# Altium project Frequenzweiche.PrjPcb
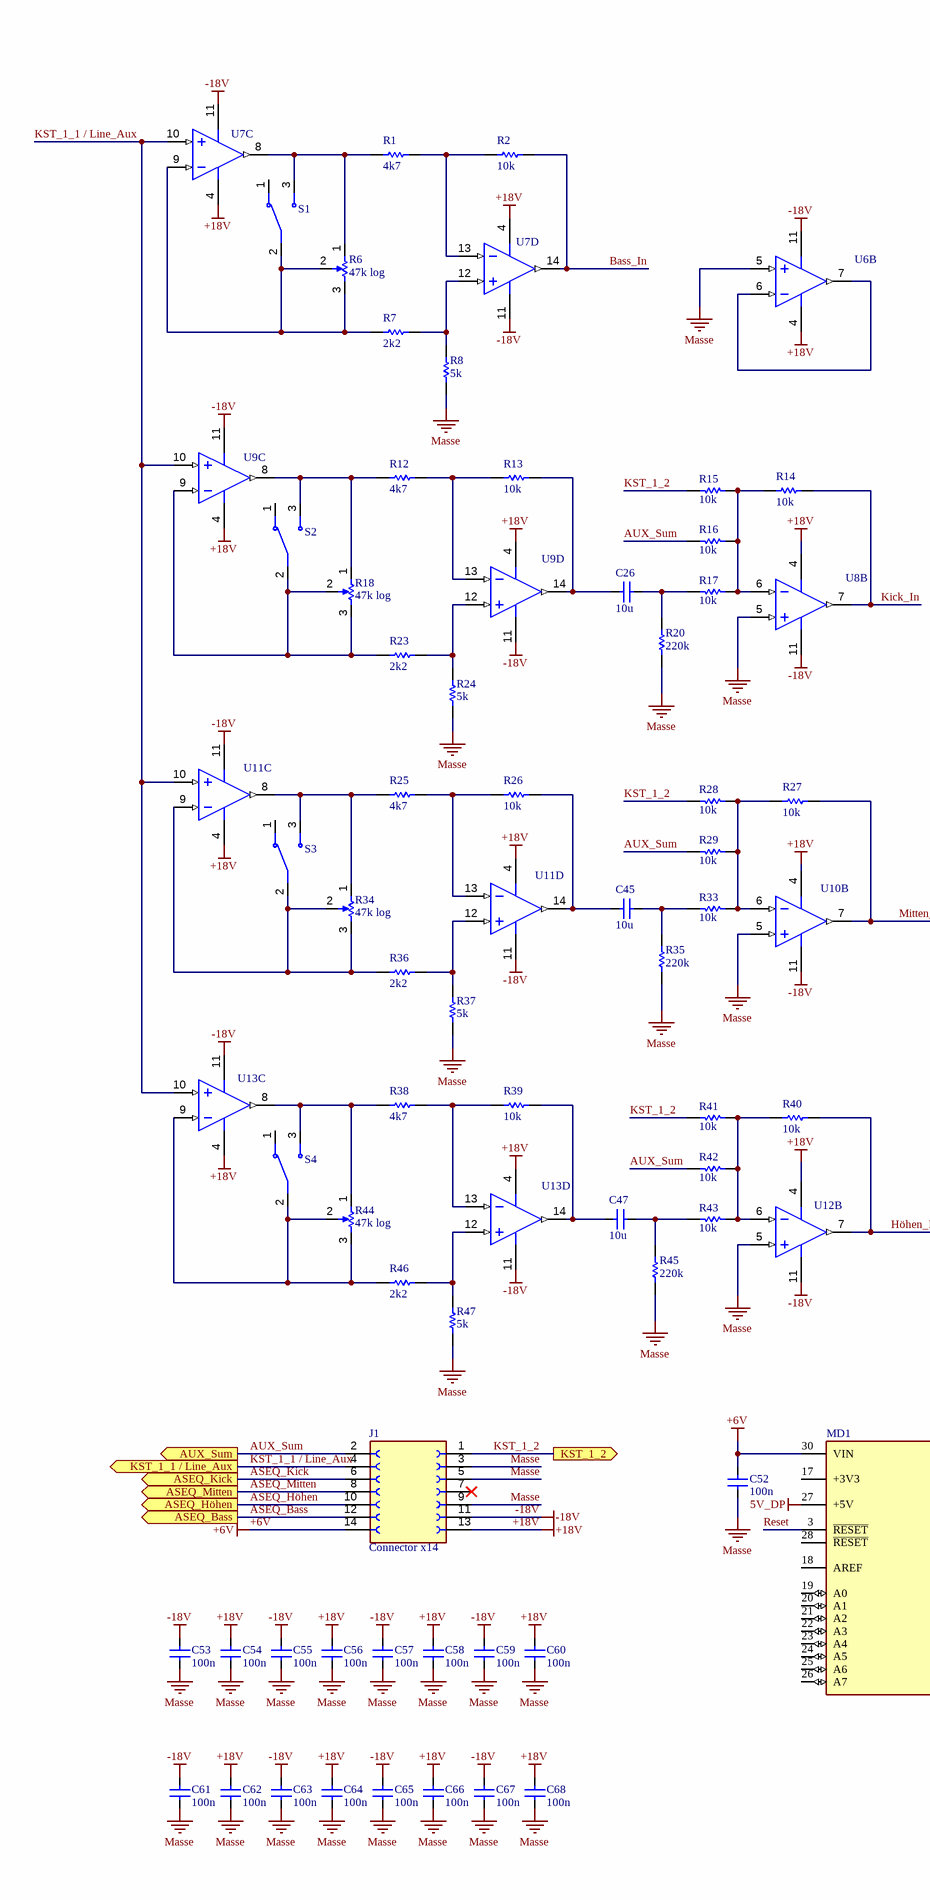
[diagram p0: Frequenzweiche.SchDoc, left]
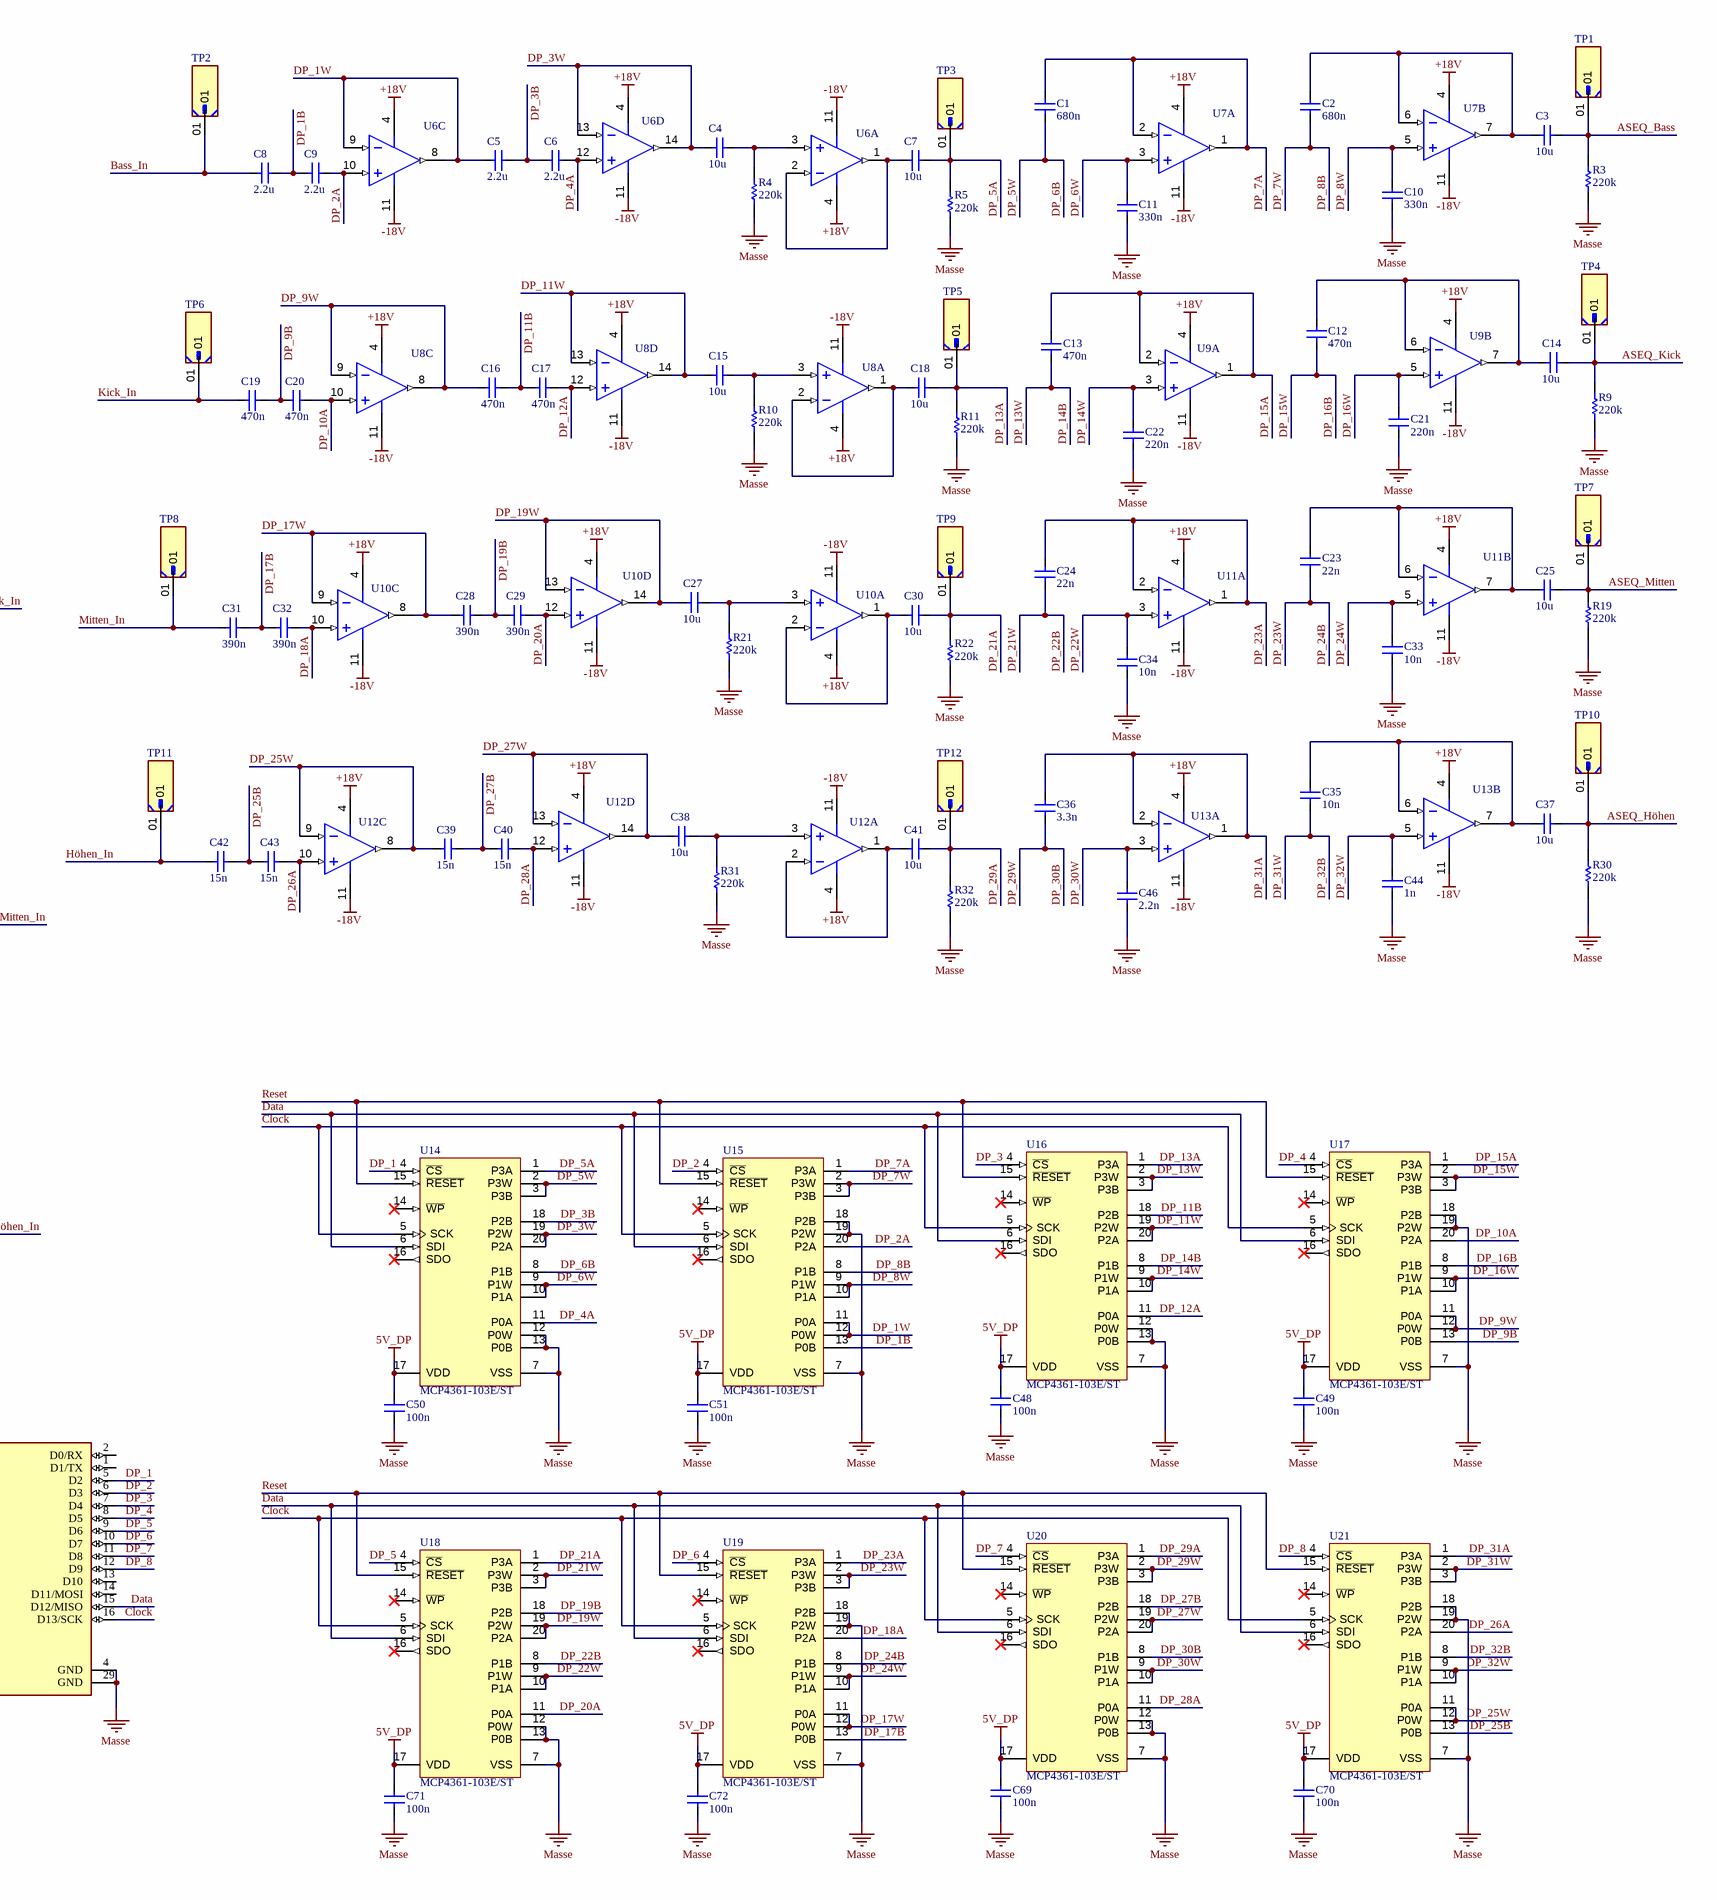
[diagram p1: Frequenzweiche.SchDoc, right]
1 sheet, 153 parts. Net scope: flat (ports and power ports of the same name join across sheets).
Board file: Frequenzweiche.PcbDoc

## Sheet Frequenzweiche.SchDoc
size A2

### Parts
C1  680n  [0805]
C2  680n  [0805]
C3  10u  [0805]
C4  10u  [0805]
C5  2.2u  [0805]
C6  2.2u  [0805]
C7  10u  [0805]
C8  2.2u  [0805]
C9  2.2u  [0805]
C10  330n  [0805]
C11  330n  [0805]
C12  470n  [0805]
C13  470n  [0805]
C14  10u  [0805]
C15  10u  [0805]
C16  470n  [0805]
C17  470n  [0805]
C18  10u  [0805]
C19  470n  [0805]
C20  470n  [0805]
C21  220n  [0805]
C22  220n  [0805]
C23  22n  [0805]
C24  22n  [0805]
C25  10u  [0805]
C26  10u  [0805]
C27  10u  [0805]
C28  390n  [0805]
C29  390n  [0805]
C30  10u  [0805]
C31  390n  [0805]
C32  390n  [0805]
C33  10n  [0805]
C34  10n  [0805]
C35  10n  [0805]
C36  3.3n  [0805]
C37  10u  [0805]
C38  10u  [0805]
C39  15n  [0805]
C40  15n  [0805]
C41  10u  [0805]
C42  15n  [0805]
C43  15n  [0805]
C44  1n  [0805]
C45  10u  [0805]
C46  2.2n  [0805]
C47  10u  [0805]
C48  100n  [0805]
C49  100n  [0805]
C50  100n  [0805]
C51  100n  [0805]
C52  100n  [0805]
C53  100n  [0805]
C54  100n  [0805]
C55  100n  [0805]
C56  100n  [0805]
C57  100n  [0805]
C58  100n  [0805]
C59  100n  [0805]
C60  100n  [0805]
C61  100n  [0805]
C62  100n  [0805]
C63  100n  [0805]
C64  100n  [0805]
C65  100n  [0805]
C66  100n  [0805]
C67  100n  [0805]
C68  100n  [0805]
C69  100n  [0805]
C70  100n  [0805]
C71  100n  [0805]
C72  100n  [0805]
J1  Connector x14  [Connector x14]
MD1  A000005  [Arduino Nano]  (value not drawn)
R1  4k7  [0805]
R2  10k  [0805]
R3  220k  [0805]
R4  220k  [0805]
R5  220k  [0805]
R6  47k log  [Connector x3]
R7  2k2  [0805]
R8  5k  [0805]
R9  220k  [0805]
R10  220k  [0805]
R11  220k  [0805]
R12  4k7  [0805]
R13  10k  [0805]
R14  10k  [0805]
R15  10k  [0805]
R16  10k  [0805]
R17  10k  [0805]
R18  47k log  [Connector x3]
R19  220k  [0805]
R20  220k  [0805]
R21  220k  [0805]
R22  220k  [0805]
R23  2k2  [0805]
R24  5k  [0805]
R25  4k7  [0805]
R26  10k  [0805]
R27  10k  [0805]
R28  10k  [0805]
R29  10k  [0805]
R30  220k  [0805]
R31  220k  [0805]
R32  220k  [0805]
R33  10k  [0805]
R34  47k log  [Connector x3]
R35  220k  [0805]
R36  2k2  [0805]
R37  5k  [0805]
R38  4k7  [0805]
R39  10k  [0805]
R40  10k  [0805]
R41  10k  [0805]
R42  10k  [0805]
R43  10k  [0805]
R44  47k log  [Connector x3]
R45  220k  [0805]
R46  2k2  [0805]
R47  5k  [0805]
S1  Schalter Buchsenleiste  [Connector x3]  (value not drawn)
S2  Schalter Buchsenleiste  [Connector x3]  (value not drawn)
S3  Schalter Buchsenleiste  [Connector x3]  (value not drawn)
S4  Schalter Buchsenleiste  [Connector x3]  (value not drawn)
TP1  Test_Pin  [Test_Pin]  (value not drawn)
TP2  Test_Pin  [Test_Pin]  (value not drawn)
TP3  Test_Pin  [Test_Pin]  (value not drawn)
TP4  Test_Pin  [Test_Pin]  (value not drawn)
TP5  Test_Pin  [Test_Pin]  (value not drawn)
TP6  Test_Pin  [Test_Pin]  (value not drawn)
TP7  Test_Pin  [Test_Pin]  (value not drawn)
TP8  Test_Pin  [Test_Pin]  (value not drawn)
TP9  Test_Pin  [Test_Pin]  (value not drawn)
TP10  Test_Pin  [Test_Pin]  (value not drawn)
TP11  Test_Pin  [Test_Pin]  (value not drawn)
TP12  Test_Pin  [Test_Pin]  (value not drawn)
U6  OPA4134UA  [DIP14 IC Socket]  (value not drawn)  (parts A,B,C,D of 4)
U7  OPA4134UA  [DIP14 IC Socket]  (value not drawn)  (parts A,B,C,D of 4)
U8  OPA4134UA  [DIP14 IC Socket]  (value not drawn)  (parts A,B,C,D of 4)
U9  OPA4134UA  [DIP14 IC Socket]  (value not drawn)  (parts A,B,C,D of 4)
U10  OPA4134UA  [DIP14 IC Socket]  (value not drawn)  (parts A,B,C,D of 4)
U11  OPA4134UA  [DIP14 IC Socket]  (value not drawn)  (parts A,B,C,D of 4)
U12  OPA4134UA  [DIP14 IC Socket]  (value not drawn)  (parts A,B,C,D of 4)
U13  OPA4134UA  [DIP14 IC Socket]  (value not drawn)  (parts A,B,C,D of 4)
U14  MCP4361-103E/ST  [MCP 4361]
U15  MCP4361-103E/ST  [MCP 4361]
U16  MCP4361-103E/ST  [MCP 4361]
U17  MCP4361-103E/ST  [MCP 4361]
U18  MCP4361-103E/ST  [MCP 4361]
U19  MCP4361-103E/ST  [MCP 4361]
U20  MCP4361-103E/ST  [MCP 4361]
U21  MCP4361-103E/ST  [MCP 4361]

### Ports
ASEQ_Bass (out), ASEQ_Höhen (out), ASEQ_Kick (out), ASEQ_Mitten (out), AUX_Sum (out), KST_1_1 / Line_Aux (out), KST_1_2 (out)

### Nets
5V_DP: C48.2 C49.2 C50.2 C51.2 C69.2 C70.2 C71.2 C72.2 MD1.27(+5V) U14.17(VDD) U15.17(VDD) U16.17(VDD) U17.17(VDD) U18.17(VDD) U19.17(VDD) U20.17(VDD) U21.17(VDD)
+6V: C52.2 J1.14 MD1.30(VIN)
+18V: C54.2 C56.2 C58.2 C60.2 C62.2 C64.2 C66.2 C68.2 J1.13 U6.4(V+) U7.4(V+) U8.4(V+) U9.4(V+) U10.4(V+) U11.4(V+) U12.4(V+) U13.4(V+)
-18V: C53.2 C55.2 C57.2 C59.2 C61.2 C63.2 C65.2 C67.2 J1.11 U6.11(V-) U7.11(V-) U8.11(V-) U9.11(V-) U10.11(V-) U11.11(V-) U12.11(V-) U13.11(V-)
Masse: C10.1 C11.1 C21.1 C22.1 C33.1 C34.1 C44.1 C46.1 C48.1 C49.1 C50.1 C51.1 C52.1 C53.1 C54.1 C55.1 C56.1 C57.1 C58.1 C59.1 C60.1 C61.1 C62.1 C63.1 C64.1 C65.1 C66.1 C67.1 C68.1 C69.1 C70.1 C71.1 C72.1 J1.3 J1.5 J1.9 MD1.4(GND) MD1.29(GND) R3.1 R4.1 R5.1 R8.1 R9.1 R10.1 R11.1 R19.1 R20.1 R21.1 R22.1 R24.1 R30.1 R31.1 R32.1 R35.1 R37.1 R45.1 R47.1 U6.5(IN_B+) U8.5(IN_B+) U10.5(IN_B+) U12.5(IN_B+) U14.7(VSS) U14.12(P0W) U14.13(P0B) U15.7(VSS) U15.18(P2B) U15.19(P2W) U16.7(VSS) U16.12(P0W) U16.13(P0B) U17.7(VSS) U17.18(P2B) U17.19(P2W) U18.7(VSS) U18.12(P0W) U18.13(P0B) U19.7(VSS) U19.18(P2B) U19.19(P2W) U20.7(VSS) U20.12(P0W) U20.13(P0B) U21.7(VSS) U21.18(P2B) U21.19(P2W)
ASEQ_Bass: C3.2 J1.12 R3.2 TP1.01 ; port ASEQ_Bass
ASEQ_Höhen: C37.2 J1.10 R30.2 TP10.01 ; port ASEQ_Höhen
ASEQ_Kick: C14.2 J1.6 R9.2 TP4.01 ; port ASEQ_Kick
ASEQ_Mitten: C25.2 J1.8 R19.2 TP7.01 ; port ASEQ_Mitten
AUX_Sum: J1.2 R16.1 R29.1 R42.1 ; port AUX_Sum
Bass_In: C8.1 R2.2 TP2.01 U7.14(OUT_D)
Clock: MD1.16(D13/SCK) U14.5(SCK) U15.5(SCK) U16.5(SCK) U17.5(SCK) U18.5(SCK) U19.5(SCK) U20.5(SCK) U21.5(SCK)
Data: MD1.15(D12/MISO) U14.6(SDI) U15.6(SDI) U16.6(SDI) U17.6(SDI) U18.6(SDI) U19.6(SDI) U20.6(SDI) U21.6(SDI)
DP_1: MD1.5(D2) U14.4(~{CS})
DP_1B: C8.2 C9.1 U15.13(P0B)
DP_1W: C5.1 U6.8(OUT_C) U6.9(IN_C-) U15.11(P0A) U15.12(P0W)
DP_2: MD1.6(D3) U15.4(~{CS})
DP_2A: C9.2 U6.10(IN_C+) U15.20(P2A)
DP_3: MD1.7(D4) U16.4(~{CS})
DP_3B: C5.2 C6.1 U14.18(P2B)
DP_3W: C4.1 U6.13(IN_D-) U6.14(OUT_D) U14.19(P2W) U14.20(P2A)
DP_4: MD1.8(D5) U17.4(~{CS})
DP_4A: C6.2 U6.12(IN_D+) U14.11(P0A)
DP_5: MD1.9(D6) U18.4(~{CS})
DP_5A: C7.2 R5.2 TP3.01 U14.1(P3A)
DP_5W: C1.1 U14.2(P3W) U14.3(P3B) U14.8(P1B)  [also labelled DP_6B]
DP_6: MD1.10(D7) U19.4(~{CS})
DP_6W: C11.2 U7.3(IN_A+) U14.9(P1W) U14.10(P1A)
DP_7: MD1.11(D8) U20.4(~{CS})
DP_7A: C1.2 U7.1(OUT_A) U7.2(IN_A-) U15.1(P3A)
DP_7W: C2.1 U15.2(P3W) U15.3(P3B) U15.8(P1B)  [also labelled DP_8B]
DP_8: MD1.12(D9) U21.4(~{CS})
DP_8W: C10.2 U7.5(IN_B+) U15.9(P1W) U15.10(P1A)
DP_9B: C19.2 C20.1 U17.13(P0B)
DP_9W: C16.1 U8.8(OUT_C) U8.9(IN_C-) U17.11(P0A) U17.12(P0W)
DP_10A: C20.2 U8.10(IN_C+) U17.20(P2A)
DP_11B: C16.2 C17.1 U16.18(P2B)
DP_11W: C15.1 U8.13(IN_D-) U8.14(OUT_D) U16.19(P2W) U16.20(P2A)
DP_12A: C17.2 U8.12(IN_D+) U16.11(P0A)
DP_13A: C18.2 R11.2 TP5.01 U16.1(P3A)
DP_13W: C13.1 U16.2(P3W) U16.3(P3B) U16.8(P1B)  [also labelled DP_14B]
DP_14W: C22.2 U9.3(IN_A+) U16.9(P1W) U16.10(P1A)
DP_15A: C13.2 U9.1(OUT_A) U9.2(IN_A-) U17.1(P3A)
DP_15W: C12.1 U17.2(P3W) U17.3(P3B) U17.8(P1B)  [also labelled DP_16B]
DP_16W: C21.2 U9.5(IN_B+) U17.9(P1W) U17.10(P1A)
DP_17B: C31.2 C32.1 U19.13(P0B)
DP_17W: C28.1 U10.8(OUT_C) U10.9(IN_C-) U19.11(P0A) U19.12(P0W)
DP_18A: C32.2 U10.10(IN_C+) U19.20(P2A)
DP_19B: C28.2 C29.1 U18.18(P2B)
DP_19W: C27.1 U10.13(IN_D-) U10.14(OUT_D) U18.19(P2W) U18.20(P2A)
DP_20A: C29.2 U10.12(IN_D+) U18.11(P0A)
DP_21A: C30.2 R22.2 TP9.01 U18.1(P3A)
DP_21W: C24.1 U18.2(P3W) U18.3(P3B) U18.8(P1B)  [also labelled DP_22B]
DP_22W: C34.2 U11.3(IN_A+) U18.9(P1W) U18.10(P1A)
DP_23A: C24.2 U11.1(OUT_A) U11.2(IN_A-) U19.1(P3A)
DP_23W: C23.1 U19.2(P3W) U19.3(P3B) U19.8(P1B)  [also labelled DP_24B]
DP_24W: C33.2 U11.5(IN_B+) U19.9(P1W) U19.10(P1A)
DP_25B: C42.2 C43.1 U21.13(P0B)
DP_25W: C39.1 U12.8(OUT_C) U12.9(IN_C-) U21.11(P0A) U21.12(P0W)
DP_26A: C43.2 U12.10(IN_C+) U21.20(P2A)
DP_27B: C39.2 C40.1 U20.18(P2B)
DP_27W: C38.1 U12.13(IN_D-) U12.14(OUT_D) U20.19(P2W) U20.20(P2A)
DP_28A: C40.2 U12.12(IN_D+) U20.11(P0A)
DP_29A: C41.2 R32.2 TP12.01 U20.1(P3A)
DP_29W: C36.1 U20.2(P3W) U20.3(P3B) U20.8(P1B)  [also labelled DP_30B]
DP_30W: C46.2 U13.3(IN_A+) U20.9(P1W) U20.10(P1A)
DP_31A: C36.2 U13.1(OUT_A) U13.2(IN_A-) U21.1(P3A)
DP_31W: C35.1 U21.2(P3W) U21.3(P3B) U21.8(P1B)  [also labelled DP_32B]
DP_32W: C44.2 U13.5(IN_B+) U21.9(P1W) U21.10(P1A)
Höhen_In: C42.1 R40.2 TP11.01 U12.7(OUT_B)
Kick_In: C19.1 R14.2 TP6.01 U8.7(OUT_B)
KST_1_1 / Line_Aux: J1.4 U7.10(IN_C+) U9.10(IN_C+) U11.10(IN_C+) U13.10(IN_C+) ; port KST_1_1 / Line_Aux
KST_1_2: J1.1 R15.1 R28.1 R41.1 ; port KST_1_2
Mitten_In: C31.1 R27.2 TP8.01 U10.7(OUT_B)
Reset: MD1.3(~{RESET}) U14.15(~{RESET}) U15.15(~{RESET}) U16.15(~{RESET}) U17.15(~{RESET}) U18.15(~{RESET}) U19.15(~{RESET}) U20.15(~{RESET}) U21.15(~{RESET})
NetC2_2: C2.2 C3.1 U7.6(IN_B-) U7.7(OUT_B)
NetC4_2: C4.2 R4.2 U6.3(IN_A+)
NetC7_1: C7.1 U6.1(OUT_A) U6.2(IN_A-)
NetC12_2: C12.2 C14.1 U9.6(IN_B-) U9.7(OUT_B)
NetC15_2: C15.2 R10.2 U8.3(IN_A+)
NetC18_1: C18.1 U8.1(OUT_A) U8.2(IN_A-)
NetC23_2: C23.2 C25.1 U11.6(IN_B-) U11.7(OUT_B)
NetC26_1: C26.1 R13.2 U9.14(OUT_D)
NetC26_2: C26.2 R17.1 R20.2
NetC27_2: C27.2 R21.2 U10.3(IN_A+)
NetC30_1: C30.1 U10.1(OUT_A) U10.2(IN_A-)
NetC35_2: C35.2 C37.1 U13.6(IN_B-) U13.7(OUT_B)
NetC38_2: C38.2 R31.2 U12.3(IN_A+)
NetC41_1: C41.1 U12.1(OUT_A) U12.2(IN_A-)
NetC45_1: C45.1 R26.2 U11.14(OUT_D)
NetC45_2: C45.2 R33.1 R35.2
NetC47_1: C47.1 R39.2 U13.14(OUT_D)
NetC47_2: C47.2 R43.1 R45.2
NetR1_1: R1.1 R6.1 S1.3 U7.8(OUT_C)
NetR1_2: R1.2 R2.1 U7.13(IN_D-)
NetR6_2: R6.2 R6.3 R7.1 S1.2 U7.9(IN_C-)
NetR7_2: R7.2 R8.2 U7.12(IN_D+)
NetR12_1: R12.1 R18.1 S2.3 U9.8(OUT_C)
NetR12_2: R12.2 R13.1 U9.13(IN_D-)
NetR14_1: R14.1 R15.2 R16.2 R17.2 U8.6(IN_B-)
NetR18_2: R18.2 R18.3 R23.1 S2.2 U9.9(IN_C-)
NetR23_2: R23.2 R24.2 U9.12(IN_D+)
NetR25_1: R25.1 R34.1 S3.3 U11.8(OUT_C)
NetR25_2: R25.2 R26.1 U11.13(IN_D-)
NetR27_1: R27.1 R28.2 R29.2 R33.2 U10.6(IN_B-)
NetR34_2: R34.2 R34.3 R36.1 S3.2 U11.9(IN_C-)
NetR36_2: R36.2 R37.2 U11.12(IN_D+)
NetR38_1: R38.1 R44.1 S4.3 U13.8(OUT_C)
NetR38_2: R38.2 R39.1 U13.13(IN_D-)
NetR40_1: R40.1 R41.2 R42.2 R43.2 U12.6(IN_B-)
NetR44_2: R44.2 R44.3 R46.1 S4.2 U13.9(IN_C-)
NetR46_2: R46.2 R47.2 U13.12(IN_D+)
NetU6_6: U6.6(IN_B-) U6.7(OUT_B)

Not connected (* = marked no-connect by the designer): J1 7*; MD1 1(D1/TX) 2(D0/RX) 13(D10) 14(D11/MOSI) 17(+3V3) 18(AREF) 19(A0) 20(A1) 21(A2) 22(A3) 23(A4) 24(A5) 25(A6) 26(A7) 28(~{RESET}); S1 1; S2 1; S3 1; S4 1; U14 14(~{WP})* 16(SDO)*; U15 14(~{WP})* 16(SDO)*; U16 14(~{WP})* 16(SDO)*; U17 14(~{WP})* 16(SDO)*; U18 14(~{WP})* 16(SDO)*; U19 14(~{WP})* 16(SDO)*; U20 14(~{WP})* 16(SDO)*; U21 14(~{WP})* 16(SDO)*

### Notes on the sheet
- THIS DOCUMENT AND THE DATA DISCLOSED HEREIN OR
- HEREWITH IS THE PROPERTY OF ALTIUM LIMITED AND MAY
- DWG NO:
- REVISION
- REV:
- DESCRIPTION
- DATE
- APPROVED
- BE FREELY DISTRIBUTED IN WHOLE. NO RIGHTS ARE
- RESERVED OR EXPRESS OR IMPLIED WARANTEE GIVEN.
- ENG:
- APPROVALS
- PROJECT
- DSN:
- CHK:
- REFERENCE DOCUMENTS
- PROJECT REVISION:
- TITLE
- DOCUMENT REVISION:
- DESIGN ITEM:
- BOM:
- FAB DWG:
- PCB DWG:
- ASSY DWG:
- SCALE:
- A3
- SIZE
- CAGE CODE
- FILE NAME
- DWG NO.
- SHEET
- OF
- REV

### Library data of the parts
C1-C72 = 0805 Kondensator
  C1 C2: Value: 680n
  C3 C4 C7 C14 C15 C18 C25-C27 C30 C37 C38 C41 C45 C47: Value: 10u
  C5 C6 C8 C9: Value: 2.2u
  C10 C11: Value: 330n
  C12 C13 C16 C17 C19 C20: Value: 470n
  C21 C22: Value: 220n
  C23 C24: Value: 22n
  C28 C29 C31 C32: Value: 390n
  C33-C35: Value: 10n
  C36: Value: 3.3n
  C39 C40 C42 C43: Value: 15n
  C44: Value: 1n
  C46: Value: 2.2n
  C48-C72: Value: 100n
J1 = Connector x14: 14 Position Header Connector Through Hole; MF: Sullins Connector; MP: SFH11-PBPC-D07-ST-BK; Value: *; Check_prices: https://www.snapeda.com/parts/SFH11-PBPC-D07-ST-BK/Sullins%20Connector%20Solutions/view-part/851415/?ref=eda; Availability: Warning; Package: None; SnapEDA_Link: https://www.snapeda.com/parts/SFH11-PBPC-D07-ST-BK/Sullins%20Connector%20Solutions/view-part/851415/?ref=snap; Purchase-URL: https://pricing.snapeda.com/search/part/SFH11-PBPC-D07-ST-BK/?ref=eda; Price: None; System: Connector
MD1 = Arduino Nano: ARDUINO NANO ATMEGA328 EVAL BRD; Number of Bits: 8; Evaluation Kit: Yes; Operating Supply Voltage: 12V; Interface: I2C; Data Bus Width: 8b; Core Architecture: AVR; Packaging: Bulk; Length: 7inch; Package Quantity: 50; Width: 5inch; REACH SVHC: No SVHC; Weight: 0.358383oz; Series: AVR® ATmega; Height: 0.25inch
R1-R5 R7-R17 R19-R33 R35-R43 R45-R47 = 0805 Widerstand
  R1 R12 R25 R38: Value: 4k7
  R2 R13-R17 R26-R29 R33 R39-R43: Value: 10k
  R3-R5 R9-R11 R19-R22 R30-R32 R35 R45: Value: 220k
  R7 R23 R36 R46: Value: 2k2
  R8 R24 R37 R47: Value: 5k
R6 R18 R34 R44 = Potentiometer Buchsenleiste: Potentiometer; Value: 47k log
S1-S4 = Schalter Buchsenleiste: Toggle Switch SPDT Through Hole; MP: 100SP1T1B4M2QE; Package: None; Price: None; Value: *; Availability: Unavailable
TP1-TP12 = Test_Pin: Connector Header Through Hole 2 position 0.100 (2.54mm); MF: Wurth Elektronik; MP: 61300211121; SnapEDA_Link: https://www.snapeda.com/parts/61300211121/Wurth+Elektronik/view-part/?ref=snap; Package: None; Value: *; Check_prices: https://www.snapeda.com/parts/61300211121/Wurth+Elektronik/view-part/?ref=eda
U6-U13 = SOIC OPA4134UA: SoundPlus(TM) High Performance Audio Operational Amplifier, 5 to 36 V, -55 to 125 degC, 14-pin SOIC (D14), Green (RoHS & no Sb/Br); Manufacturer: Texas Instruments; Vmax(V): 36; Number of Channels: 4; Iq per channel(Max)(mA): 5; GBW(Typ)(MHz): 8; DatasheetVersion: SBOS058; ComponentLink2URL: http://www.ti.com/general/docs/lit/getliterature.tsp?genericPartNumber=OPA4134&fileType=pdf; ComponentLink1URL: http://www.ti.com/; PackageDescription: 14-Pin Plastic Small Outline, Body 8.65 x 3.9 mm, Pitch 1.27 mm; SubFamily: Audio Operational Amplifier; Vmin(V): 5; ComponentLink2Description: Datasheet; PackageVersion: 4040047-5/M, 06/2011; Code_JEDEC: MS-012; PackageReference: D0014A; ComponentLink1Description: Manufacturer URL; Vn at Flatband(Typ)(nV/rtHz): 8; Eco-Plan: Green (RoHS & no Sb/Br); Mounting Technology: Surface Mount; ComponentLink3URL: http://www.ti.com/lit/ml/mpds177g/mpds177g.pdf; PartNumber: OPA4134UA; ComponentLink3Description: Package Specification
U14-U21 = MCP 4361: 7/8-Bit Quad SPI Digital POT with Non-Volatile Memory, 20-Pin TSSOP, Extended Temperature; ComponentLink2URL: http://ww1.microchip.com/downloads/en/DeviceDoc/22233a.pdf; PackageVersion: revBB, Aug-2009; Code_JEDEC: MO-153-AC; ComponentLink1Description: Manufacturer URL; DatasheetVersion: revA, Dec-2009; ComponentLink1URL: http://www.microchip.com/; PackageDescription: 20-Lead Plastic Thin Shrink Small Outline (ST) - 4.4mm Body [TSSOP]; ComponentLink3Description: Package Specification; PackageReference: TSSOP-ST20; ComponentLink3URL: http://www.microchip.com/stellent/groups/techpub_sg/documents/packagingspec/en012702.pdf; ComponentLink2Description: Datasheet